# Altium schematic sheet Main.SchDoc: Antenna cirduit
size 330 x 269 mm; Date: 31.10.2021; ApprovedBy: Machacek Tomas; CheckedBy: Machacek Tomas; Author: Machacek Tomas; DrawnBy: Machacek Tomas; Engineer: Machacek Tomas; Revision: Machacek Tomas; SheetNumber: 1; SheetTotal: 1
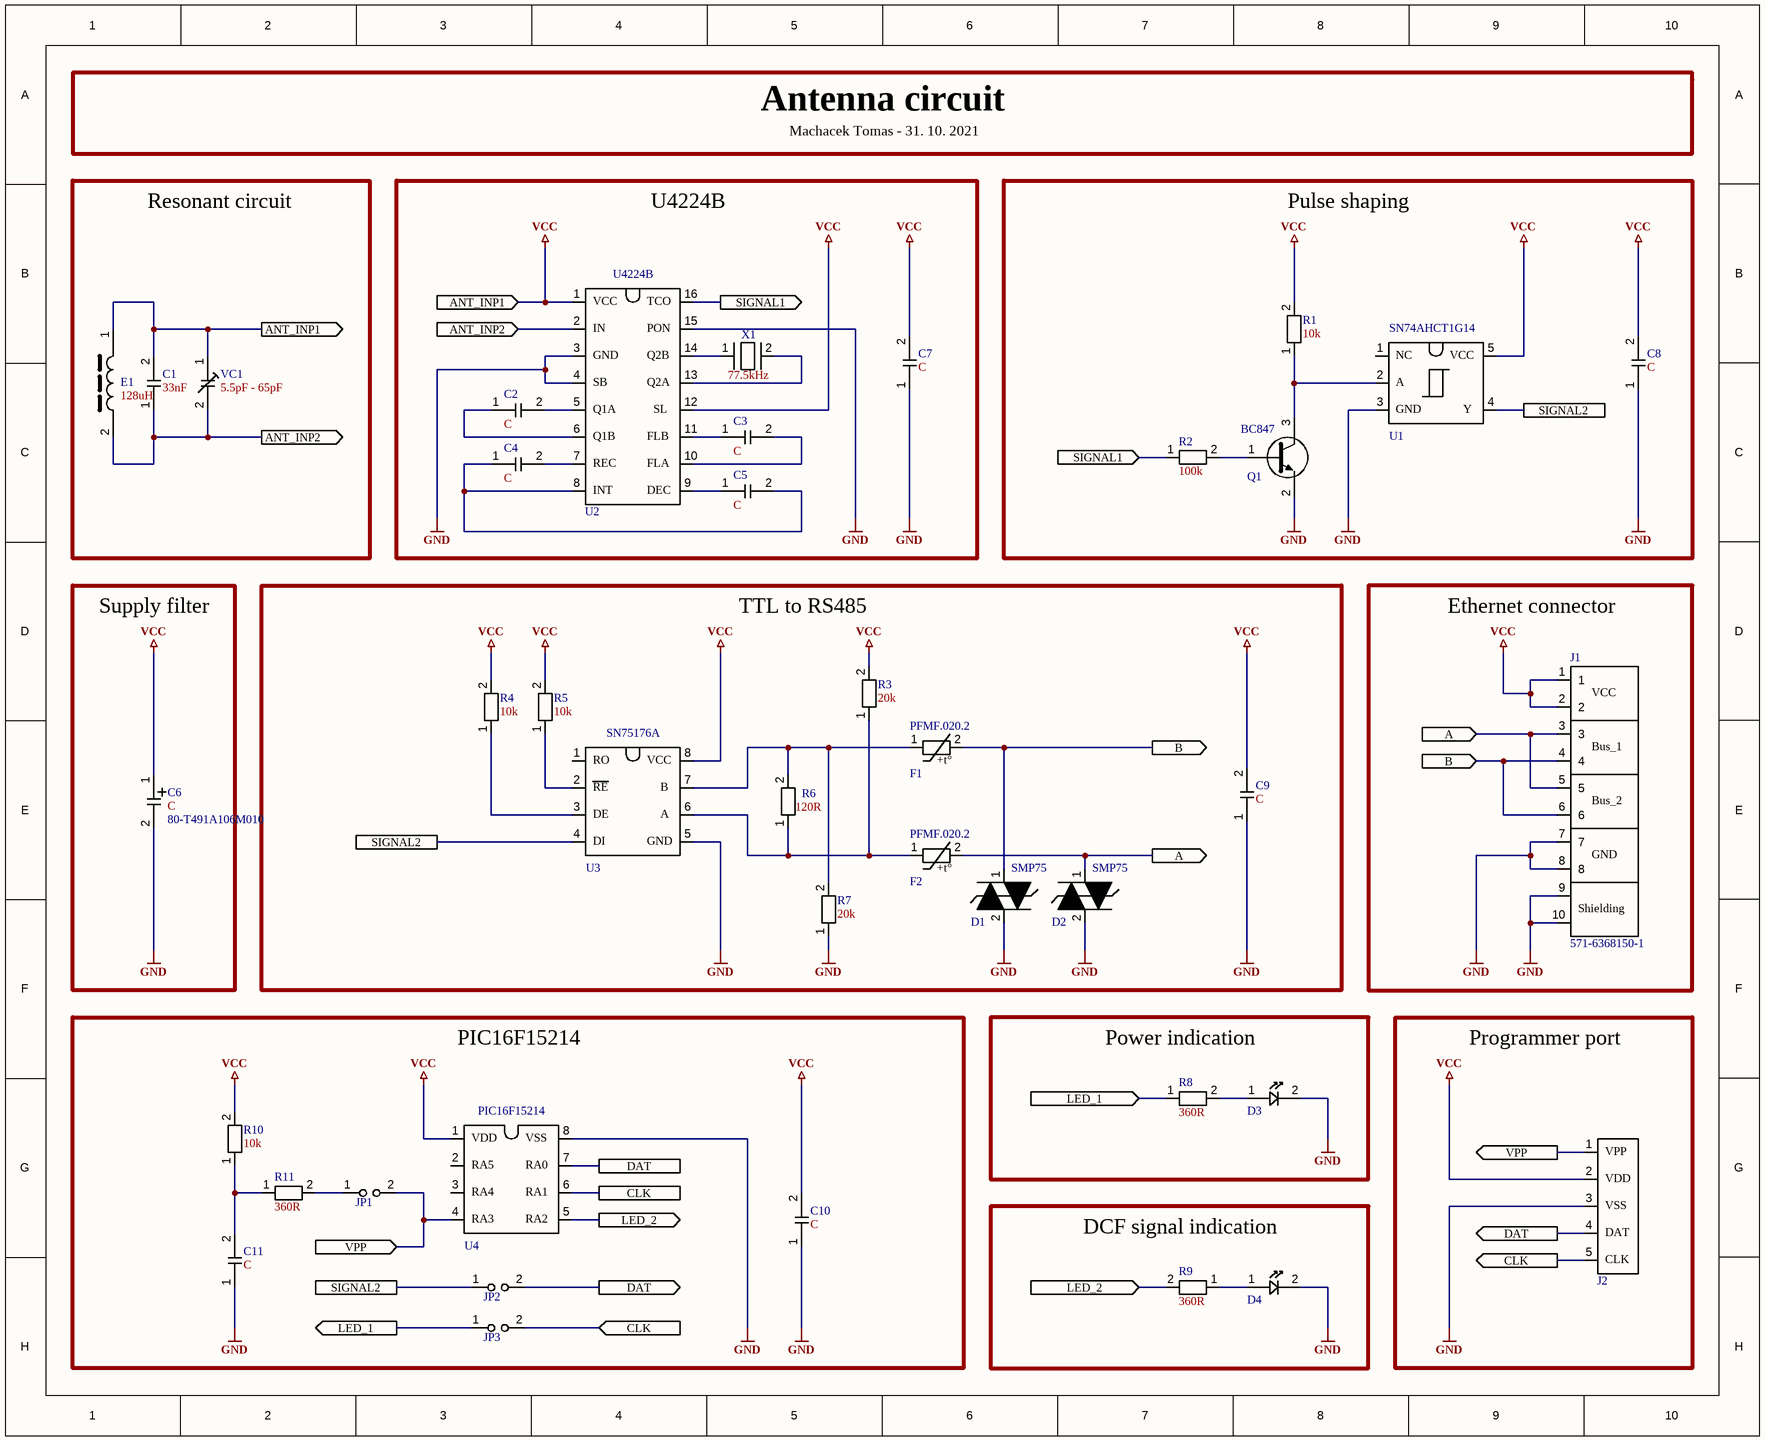
[diagram p0: Main.SchDoc]

## Parts
C1  value 33nF  [Film_capacitator]  (hidden comment: Capacitator_film)
C2  value C  [MLCC_capacitator]  (hidden comment: Capacitator_MLCC)
C3  value C  [MLCC_capacitator]  (hidden comment: Capacitator_MLCC)
C4  value C  [MLCC_capacitator]  (hidden comment: Capacitator_MLCC)
C5  value C  [MLCC_capacitator]  (hidden comment: Capacitator_MLCC)
C6  value C  Supplier Part Number 1: 80-T491A106M010  [Tantalum_capacitor]  (hidden comment: Capacitator_aluminium)
C7  value C  [MLCC_capacitator]  (hidden comment: Capacitator_MLCC)
C8  value C  [MLCC_capacitator]  (hidden comment: Capacitator_MLCC)
C9  value C  [MLCC_capacitator]  (hidden comment: Capacitator_MLCC)
C10  value C  [MLCC_capacitator]  (hidden comment: Capacitator_MLCC)
C11  value C  [MLCC_capacitator]  (hidden comment: Capacitator_MLCC)
D1  SMP75  [SMP75]
D2  SMP75  [SMP75]
D3  Indication_led  [indication_led]  (value not drawn)
D4  Indication_led  [indication_led]  (value not drawn)
E1  value 128uH  [Antenna]  (hidden comment: Ferrite_antenna)
F1  PFMF.020.2  [PFMF.020.2]
F2  PFMF.020.2  [PFMF.020.2]
J1  Supplier Part Number 1: 571-6368150-1  [Ethernet_connector]  (hidden comment: Ethernet_connector)
J2  Programmer_port  [Programmer_port]  (value not drawn)
JP1  Jumper  [Jumper]  (value not drawn)
JP2  Jumper  [Jumper]  (value not drawn)
JP3  Jumper  [Jumper]  (value not drawn)
Q1  BC847  [BC847]
R1  value 10k  [Resistor]  (hidden comment: Resistor)
R2  value 100k  [Resistor]  (hidden comment: Resistor)
R3  value 20k  [Resistor]  (hidden comment: Resistor)
R4  value 10k  [Resistor]  (hidden comment: Resistor)
R5  value 10k  [Resistor]  (hidden comment: Resistor)
R6  value 120R  [Resistor]  (hidden comment: Resistor)
R7  value 20k  [Resistor]  (hidden comment: Resistor)
R8  value 360R  [Resistor]  (hidden comment: Resistor)
R9  value 360R  [Resistor]  (hidden comment: Resistor)
R10  value 10k  [Resistor]  (hidden comment: Resistor)
R11  value 360R  [Resistor]  (hidden comment: Resistor)
U1  SN74AHCT1G14  [SN74AHCT1G14]
U2  U4224B  [U422B]
U3  SN75176A  [SN75176A]
U4  PIC16F15214  [PIC16F15214]
VC1  value 5.5pF - 65pF  [Trimmer_capacitator]  (hidden comment: Trimmer_capacitor)
X1  value 77.5kHz  [Crystal]  (hidden comment: Crystal)

## Blocks framed on the sheet
Resonant circuit: C1 E1 VC1
U4224B: C2-C5 C7 U2 X1
Pulse shaping: C8 Q1 R1 R2 U1
Supply filter: C6
TTL to RS485: C9 D1 D2 F1 F2 R3-R7 U3
Ethernet connector: J1
PIC16F15214: C10 C11 JP1-JP3 R10 R11 U4
Power indication: D3 R8
Programmer port: J2
DCF signal indication: D4 R9

## Ports
A (in), A (out), ANT_INP1 (in), ANT_INP1 (out), ANT_INP2 (in), ANT_INP2 (out), B (in), B (out), CLK, CLK (in), CLK (out), DAT, DAT (out), LED_1 (in), LED_1 (out), LED_2 (in), LED_2 (out), SIGNAL1 (in), SIGNAL1 (out), SIGNAL2, VPP (in), VPP (out)

## Nets
GND: C6.2 C7.1 C8.1 C9.1 C10.1 C11.1 D1.2 D2.2 D3.2 D4.2 J1.7 J1.8 J1.9 J1.10 J2.3 Q1.2 R7.1 U1.3 U2.3 U2.4 U2.15 U3.5 U4.8
VCC: C1.2 C6.1 C7.2 C8.2 C9.2 C10.2 E1.1 J1.1 J1.2 J2.2 R1.2 R3.2 R4.2 R5.2 R10.2 U1.5 U2.1 U2.12 U3.8 U4.1 VC1.1 ; port ANT_INP1
A: D2.1 F2.2 J1.3 J1.5 ; port A
ANT_INP2: C1.1 E1.2 U2.2 VC1.2 ; port ANT_INP2
B: D1.1 F1.2 J1.4 J1.6 ; port B
CLK: J2.5 JP3.2 U4.6 ; port CLK
DAT: J2.4 JP2.2 U4.7 ; port DAT
LED_1: JP3.1 R8.1 ; port LED_1
LED_2: R9.2 U4.5 ; port LED_2
SIGNAL1: R2.1 U2.16 ; port SIGNAL1
SIGNAL2: JP2.1 U1.4 U3.4 ; port SIGNAL2
VPP: J2.1 JP1.2 U4.4 ; port VPP
NetC2_1: C2.1 U2.6
NetC2_2: C2.2 U2.5
NetC3_1: C3.1 U2.11
NetC3_2: C3.2 U2.10
NetC4_1: C4.1 C5.2 U2.8
NetC4_2: C4.2 U2.7
NetC5_1: C5.1 U2.9
NetC11_2: C11.2 R10.1 R11.1
NetD3_1: D3.1 R8.2
NetD4_1: D4.1 R9.1
NetF1_1: F1.1 R6.2 R7.2 U3.7
NetF2_1: F2.1 R3.1 R6.1 U3.6
NetJP1_1: JP1.1 R11.2
NetQ1_1: Q1.1 R2.2
NetQ1_3: Q1.3 R1.1 U1.2
NetR4_1: R4.1 U3.3
NetR5_1: R5.1 U3.2
NetU2_13: U2.13 X1.2
NetU2_14: U2.14 X1.1

Not connected (* = marked no-connect by the designer): U1 1; U3 1; U4 2 3

## Notes on the sheet
- Antenna circuit
- Machacek Tomas - 31. 10. 2021
- DWG. NO.
- REV.
- SHT.
- REVISION
- DESCRIPTION
- DATE
- APPROVED
- THIS DOCUMENT AND THE DATA DISCLOSED HEREIN OR HEREWITH IS THE PROPERTY OF ALTIUM LIMITED AND MAY BE FREELY DISTRIBUTED IN WHOLE. NO RIGHTS ARE RESERVED OR EXPRESS OR IMPLIED WARANTEE GIVEN.
- ENG:
- DSN:
- APPROVALS
- PROJECT
- DOCUMENT REVISION:
- DESIGN ITEM:
- CHK:
- BOM:
- REFERENCE DOCUMENTS
- PROJECT REVISION:
- TITLE
- FAB DWG:
- PCB DWG:
- ASSY DWG:
- SCALE:
- SIZE
- C
- CAGE CODE
- FILE NAME
- DWG NO.
- SHEET
- OF
- REV
- (in symbol Ethernet_connector) VCC; Bus_1; Bus_2; GND; Shielding
- (in symbol PFMF.020.2) +t°
- (in symbol PIC16F15214) VDD; VSS; RA5; RA0; RA4; RA1; RA3; RA2
- (in symbol Programmer_port) VPP; VDD; VSS; DAT; CLK
- (in symbol SN74AHCT1G14) NC; VCC; A; GND; Y
- (in symbol SN75176A) RO; VCC; RE; B; DE; A; DI; GND
- (in symbol U4224B) VCC; TCO; IN; PON; GND; Q2B; SB; Q2A; Q1A; SL; Q1B; FLB; REC; FLA; INT; DEC

## Library data of the parts
C1 = Capacitator_film: Film capacitator; Supplier 1: Mouser; Supplier Part Number 1: 505-SMDID02330KA00KP
C2-C5 C7-C11 = Capacitator_MLCC: MLCC capacitator - 1206
C6 = Capacitator_aluminium: Aluminum capacitator - filtration; Supplier 1: Mouser
D1 D2 = SMP75: Bidirectional crowbar protection; Supplier 1: Mouser; Supplier Part Number 1: 511-SMP75-8
D3 D4 = Indication_led: Indication led to panel; Supplier 1: Mouser; Supplier Part Number 1: 593-L63DR2L
E1 = Ferrite_antenna: Ferrite antenna
F1 F2 = PFMF.020.2: SMD fuse; Supplier 1: Mouser; Supplier Part Number 1: 693-PFMF.020.2
J1 = Ethernet_connector: Ethernet connector; Supplier 1: Mouser
J2 = Programmer_port: Programmer port for PIC
JP1-JP3 = Jumper: Solderable jumper
Q1 = BC847: NPN transistor; Supplier 1: Mouser; Supplier Part Number 1: 771-BC847215
R1-R11 = Resistor: SMD resistor - 1206
U1 = SN74AHCT1G14: SINGLE SCHMITT-TRIGGER INVERTER GATE; Supplier 1: Mouser; Supplier Part Number 1: 595-SN74AHCT1G14DBVR
U2 = U4224B: DCF77 signal decoder
U3 = SN75176A: RS485 transreciever; Supplier 1: Mouser; Supplier Part Number 1: 595-SN75176ADG4
U4 = PIC16F15214: 8-bit microcontroller; Supplier 1: Mouser; Supplier Part Number 1: 579-PIC16F18313-E/SN
VC1 = Trimmer_capacitator: Film dielectric trimmer; Supplier 1: Mouser; Supplier Part Number 1: 594-2222-808-31659
X1 = Crystal: Quartz crystal